# EAGLE design W700X (EAGLE 6.6.0)
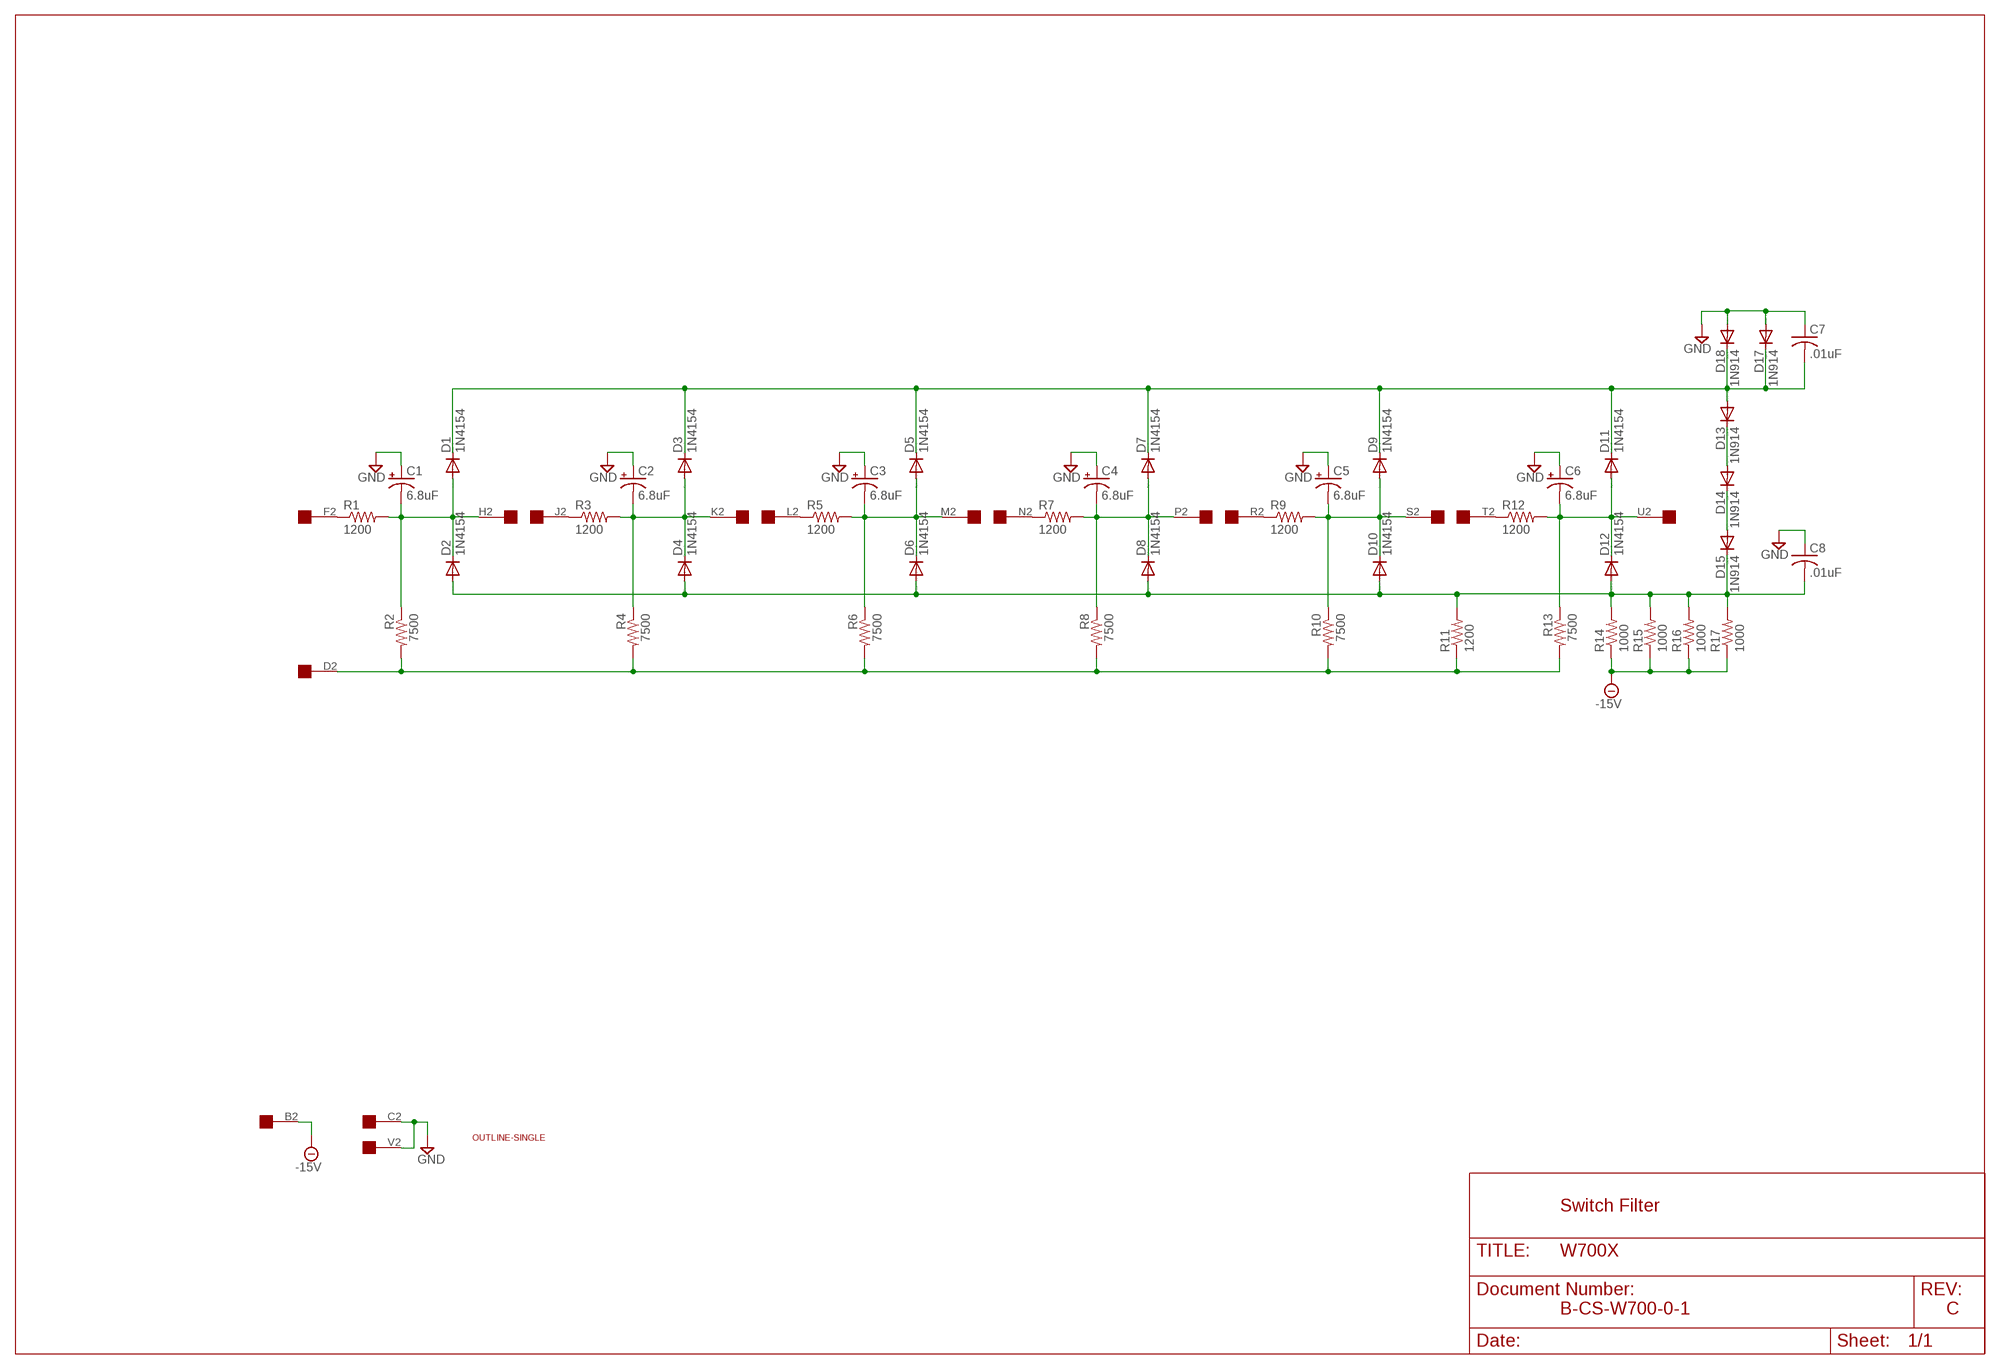
[diagram p0: schematic, sheet 1]

## Parts
C1  6.8uF  CPOL-USE20-8AXIAL  [E12-8]
C2  6.8uF  CPOL-USE20-8AXIAL  [E12-8]
C3  6.8uF  CPOL-USE20-8AXIAL  [E12-8]
C4  6.8uF  CPOL-USE20-8AXIAL  [E12-8]
C5  6.8uF  CPOL-USE20-8AXIAL  [E12-8]
C6  6.8uF  CPOL-USE20-8AXIAL  [E12-8]
C7  .01uF  C-US150-054X183  [C150-054X183]
C8  .01uF  C-US150-054X183  [C150-054X183]
D1  1N4154  DIODE-DO35-10  [DO35-10]
D2  1N4154  DIODE-DO35-10  [DO35-10]
D3  1N4154  DIODE-DO35-10  [DO35-10]
D4  1N4154  DIODE-DO35-10  [DO35-10]
D5  1N4154  DIODE-DO35-10  [DO35-10]
D6  1N4154  DIODE-DO35-10  [DO35-10]
D7  1N4154  DIODE-DO35-10  [DO35-10]
D8  1N4154  DIODE-DO35-10  [DO35-10]
D9  1N4154  DIODE-DO35-10  [DO35-10]
D10  1N4154  DIODE-DO35-10  [DO35-10]
D11  1N4154  DIODE-DO35-10  [DO35-10]
D12  1N4154  DIODE-DO35-10  [DO35-10]
D13  1N914  DIODE-DO35-10  [DO35-10]
D14  1N914  DIODE-DO35-10  [DO35-10]
D15  1N914  DIODE-DO35-10  [DO35-10]
D17  1N914  DIODE-DO35-10  [DO35-10]
D18  1N914  DIODE-DO35-10  [DO35-10]
R1  1200  R-US_0207/10  [0207/10]
R2  7500  R-US_0207/10  [0207/10]
R3  1200  R-US_0207/10  [0207/10]
R4  7500  R-US_0207/10  [0207/10]
R5  1200  R-US_0207/10  [0207/10]
R6  7500  R-US_0207/10  [0207/10]
R7  1200  R-US_0207/10  [0207/10]
R8  7500  R-US_0207/10  [0207/10]
R9  1200  R-US_0207/10  [0207/10]
R10  7500  R-US_0207/10  [0207/10]
R11  1200  R-US_0207/10  [0207/10]
R12  1200  R-US_0207/10  [0207/10]
R13  7500  R-US_0207/10  [0207/10]
R14  1000  R-US_0207/10  [0207/10]
R15  1000  R-US_0207/10  [0207/10]
R16  1000  R-US_0207/10  [0207/10]
R17  1000  R-US_0207/10  [0207/10]
U$1  OUTLINE-SINGLE  [SINGLE]
U$3  EDGE-1  [EDGE-CON1]

## Nets
-15V: R14.1 R15.1 R16.1 R17.1 U$3.B2
D2: R2.2 R4.2 R6.2 R8.2 R10.2 R11.1 R13.2 U$3.D2
F2: R1.1 U$3.F2
GND: C1.+ C2.+ C3.+ C4.+ C5.+ C6.+ C7.1 C8.1 D17.A D18.A U$3.C2 U$3.V2
H2: C1.- D1.A D2.C R1.2 R2.1 U$3.H2
J2: R3.1 U$3.J2
K2: C2.- D3.A D4.C R3.2 R4.1 U$3.K2
L2: R5.1 U$3.L2
N$1: C8.2 D2.A D4.A D6.A D8.A D10.A D12.A D15.C R11.2 R14.2 R15.2 R16.2 R17.2
N$2: R7.1 U$3.N2
N$3: C3.- D5.A D6.C R5.2 R6.1 U$3.M2
N$4: C7.2 D1.C D3.C D5.C D7.C D9.C D11.C D13.A D17.C D18.C
N$5: D14.C D15.A
N$6: D13.C D14.A
P2: C4.- D7.A D8.C R7.2 R8.1 U$3.P2
R2: R9.1 U$3.R2
S2: C5.- D9.A D10.C R9.2 R10.1 U$3.S2
T2: R12.1 U$3.T2
U2: C6.- D11.A D12.C R12.2 R13.1 U$3.U2
Unconnected: U$3.A2 U$3.E2

## Notes on the sheet
- Switch Filter
- B-CS-W700-0-1 | C

## Library data of the parts
C1-C6 = dec-con:CPOL-USE20-8AXIAL: A 0.8 inch electrolytic.
C7 C8 = rcl:C-US: CAPACITOR, American symbol
D1-D15 D17 D18 = diode:DIODE-: DIODE
R1-R17 = rcl:R-US_: RESISTOR, American symbol
U$1 = dec-con:OUTLINE-*: Board outlines for DEC boards.
U$3 = dec-con:EDGE-1: Single-Sided DEC Edge Connector -- (side 2)

## Board
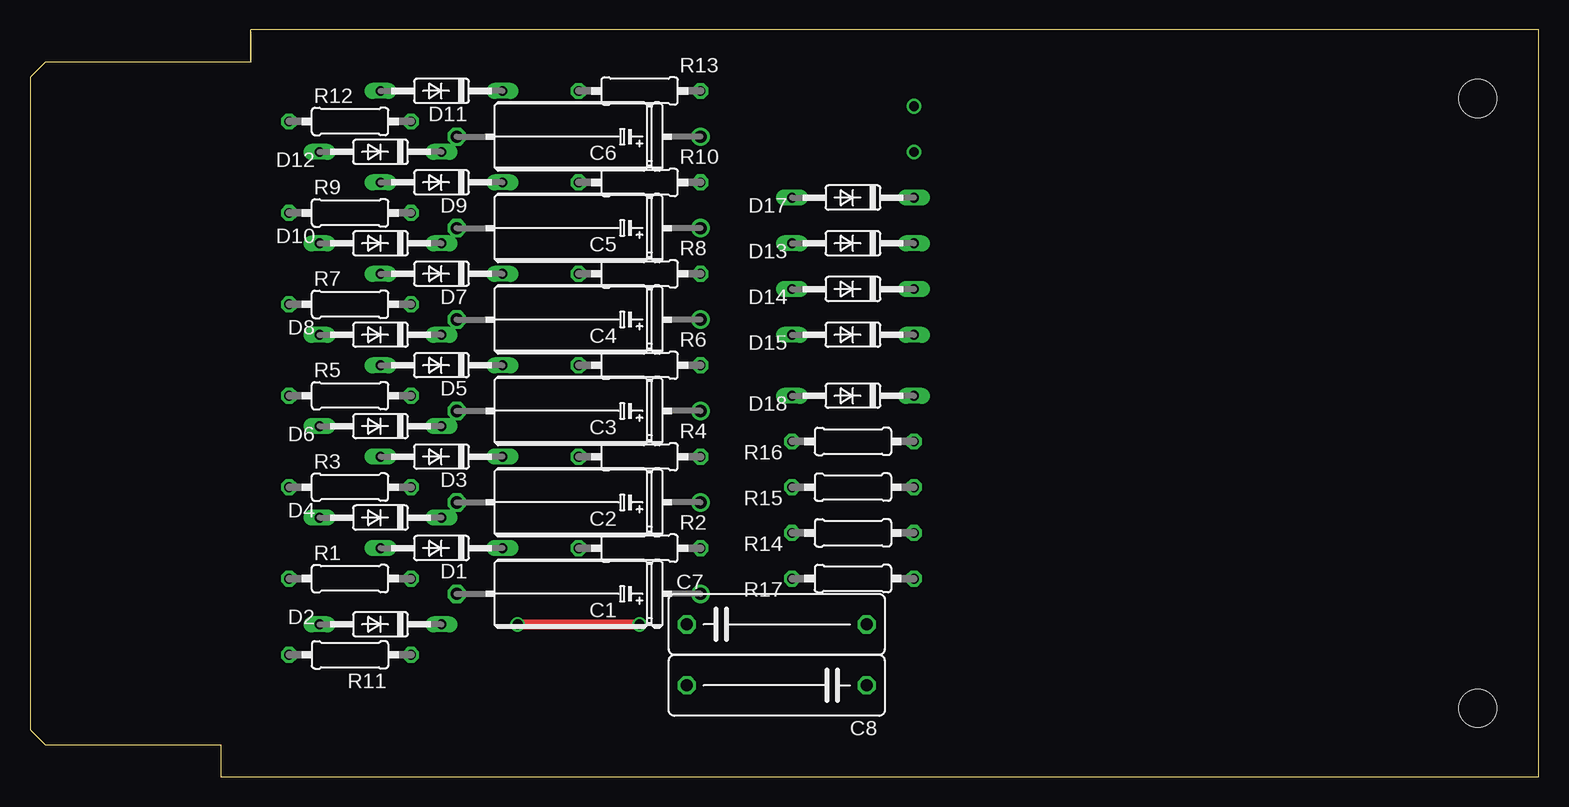
[diagram p1: board, top side]
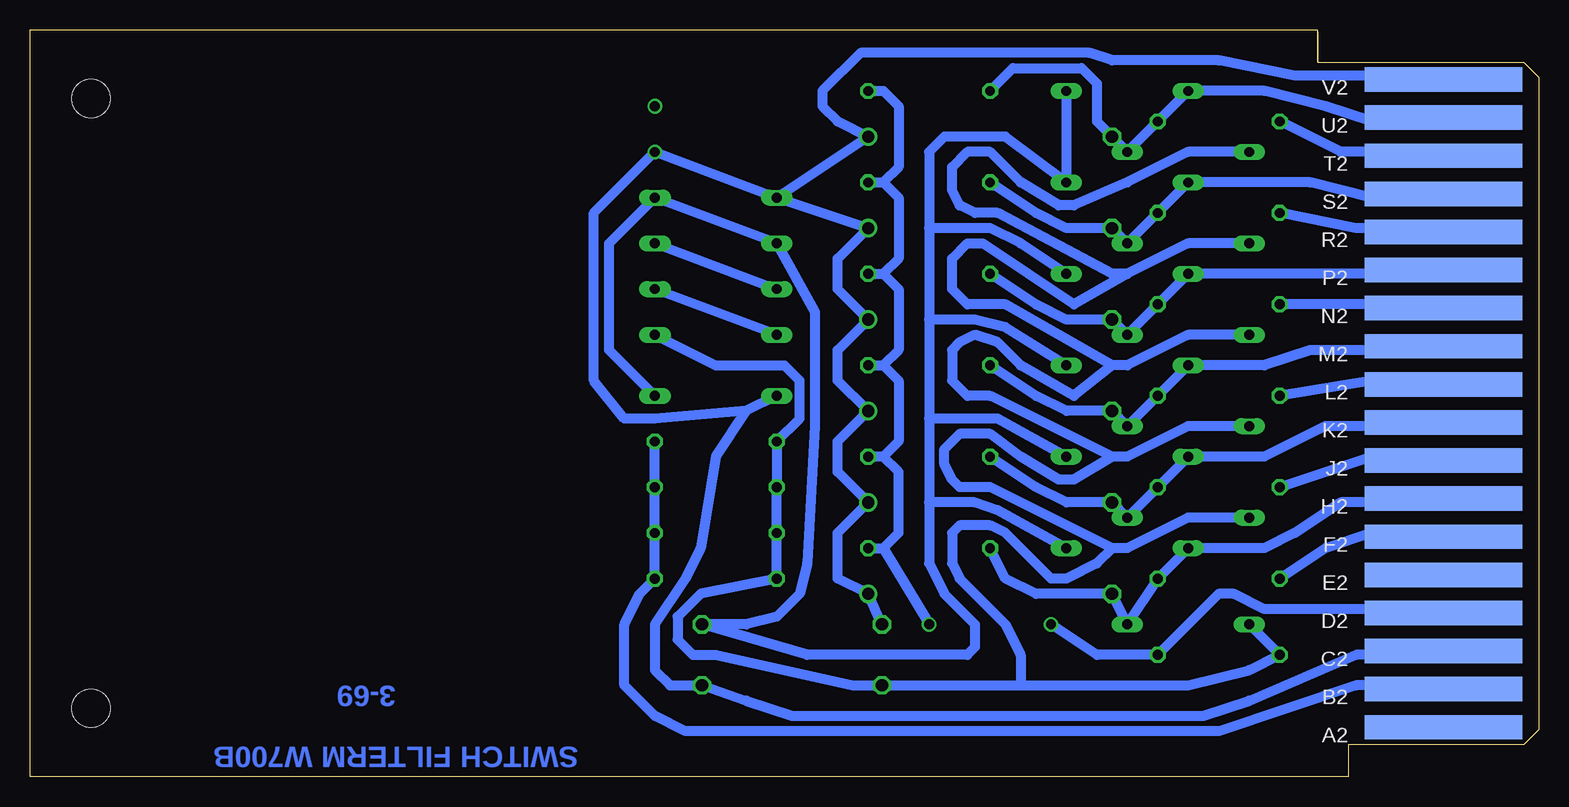
[diagram p2: board, bottom side, seen from below]

Size 125.73 x 62.23 mm. Coordinates in mm from the lower left corner, seen from the top.
Copper layers (1+16): Top 0.035mm / dielectric 1.5mm / Bottom 0.035mm
Design rules "16mils": minimum track width 16mil, minimum drill 32mil, track to track 15mil, track to pad 10mil, pad to pad 10mil, via to via 10mil, smd to smd 10mil, copper to edge 13mil, drill to drill 10mil, minimum pad ring 10mil, minimum via ring 8mil, stop-mask expansion 0mil, vias tented up to drill 0mil, thermal gap 10mil

### Footprints (pad centres in the part's own frame; a part is rotated, then mirrored left to right if it is on the bottom)
E12-8 = drill 1.016: + -10.16,0 | drill 1.016 octagon: - 10.16,0
C150-054X183 = drill 1.016 octagon: 1 -7.493,0; 2 7.493,0
DO35-10 = drill 0.813 long: A 5.08,0; C -5.08,0
0207/10 = drill 0.813 octagon: 1 -5.08,0; 2 5.08,0
SINGLE = hole 3.175: 120.65,56.515; 120.65,5.715
EDGE-CON1 = smd 13.106 x 2.032 bottom: A2 7.938,4.128; B2 7.938,7.303; C2 7.938,10.477; D2 7.938,13.652; E2 7.938,16.828; F2 7.938,20.003; H2 7.938,23.177; J2 7.938,26.352; K2 7.938,29.527; L2 7.938,32.703; M2 7.938,35.877; N2 7.938,39.053; P2 7.938,42.227; R2 7.938,45.403; S2 7.938,48.578; T2 7.938,51.752; U2 7.938,54.928; V2 7.938,58.102

### Placement (x,y rotation side)
C1  45.72,15.24 180 top
C2  45.72,22.86 180 top
C3  45.72,30.48 180 top
C4  45.72,38.1 180 top
C5  45.72,45.72 180 top
C6  45.72,53.34 180 top
C7  62.23,12.7 0 top
C8  62.23,7.62 180 top
D1  34.29,19.05 180 top
D2  29.21,12.7 180 top
D3  34.29,26.67 180 top
D4  29.21,21.59 180 top
D5  34.29,34.29 180 top
D6  29.21,29.21 180 top
D7  34.29,41.91 180 top
D8  29.21,36.83 180 top
D9  34.29,49.53 180 top
D10  29.21,44.45 180 top
D11  34.29,57.15 180 top
D12  29.21,52.07 180 top
D13  68.58,44.45 180 top
D14  68.58,40.64 180 top
D15  68.58,36.83 180 top
D17  68.58,48.26 180 top
D18  68.58,31.75 180 top
R1  26.67,16.51 0 top
R2  50.8,19.05 0 top
R3  26.67,24.13 0 top
R4  50.8,26.67 0 top
R5  26.67,31.75 0 top
R6  50.8,34.29 0 top
R7  26.67,39.37 0 top
R8  50.8,41.91 0 top
R9  26.67,46.99 0 top
R10  50.8,49.53 0 top
R11  26.67,10.16 180 top
R12  26.67,54.61 0 top
R13  50.8,57.15 0 top
R14  68.58,20.32 180 top
R15  68.58,24.13 180 top
R16  68.58,27.94 180 top
R17  68.58,16.51 180 top
U$1  0,0 0 top
U$3  0,0 0 top

### Tracks (layer width: path | path; a pad name or v marks a point on that pad's centre or on a via)
-15V
  Bottom 0.813: R16.1 R15.1 R14.1 R17.1 74.93,15.24 76.2,12.7 76.2,7.62 73.66,5.08 71.12,3.81 26.67,3.81 15.24,7.62 8.89,7.62 U$3.B2
D2  (via drill 0.81)
  Top 0.813: v40.64,12.7 v50.8,12.7
  Bottom 0.813: R8.2 54.61,41.91 | 54.61,41.91 53.34,40.64 53.34,35.56 54.61,34.29 | R10.2 54.61,49.53 | 54.61,49.53 53.34,48.26 53.34,43.18 54.61,41.91 | R6.2 54.61,34.29 | 54.61,34.29 53.34,33.02 53.34,27.94 54.61,26.67 | 54.61,26.67 R4.2 | R2.2 54.61,19.05 | 54.61,19.05 53.34,20.32 53.34,25.4 54.61,26.67 | R13.2 54.61,57.15 53.34,55.88 53.34,50.8 54.61,49.53 | v40.64,12.7 36.83,10.16 R11.1 26.67,15.24 25.4,15.24 22.86,13.97 8.89,13.97 U$3.D2 | 54.61,19.05 v50.8,12.7
F2
  Bottom 0.813: U$3.F2 8.89,20.32 13.97,20.32 17.78,19.05 R1.1
GND  (via drill 0.81)
  Bottom 0.813: U$3.V2 8.89,58.42 20.32,58.42 26.67,59.69 35.56,59.69 37.47,60.33 56.52,60.33 59.69,57.15 59.69,55.88 58.42,54.61 C6.+ D17.A | D17.A C5.+ 58.42,43.18 58.42,40.64 C4.+ 58.42,35.56 58.42,33.02 C3.+ 58.42,27.94 58.42,25.4 C2.+ 58.42,20.32 58.42,16.51 C1.+ C7.1 | D18.A 66.04,30.48 | 66.04,30.48 73.66,29.84 76.2,29.84 78.74,33.02 78.74,46.99 v73.66,52.07 D17.A | U$3.C2 8.89,10.16 15.24,10.16 24.13,6.35 27.94,5.08 62.23,5.08 66.04,6.35 C8.1 72.39,7.62 73.66,8.89 73.66,12.7 71.12,16.51 69.85,19.05 68.58,26.67 66.04,30.48
H2
  Bottom 0.813: U$3.H2 8.89,22.86 16.51,22.86 20.32,20.32 22.86,19.05 D1.A R1.2 D2.C C1.- 41.91,15.24 44.45,16.51 R2.1
J2
  Bottom 0.813: U$3.J2 8.89,26.67 13.97,26.67 R3.1
K2
  Bottom 0.813: U$3.K2 8.89,29.21 17.78,29.21 22.86,26.67 D3.A R3.2 D4.C C2.- 39.37,22.86 41.91,24.13 R4.1
L2
  Bottom 0.813: U$3.L2 8.89,33.02 13.97,33.02 R5.1
N$1
  Bottom 0.813: D15.C 68.58,34.29 62.87,34.29 61.6,33.02 61.6,29.84 R16.2 R15.2 R14.2 R17.2 69.85,15.24 71.76,13.34 71.76,11.43 70.49,10.16 68.58,10.16 57.15,7.62 C8.2 43.18,7.62 | 43.18,7.62 29.21,7.62 24.13,8.89 R11.2 D2.A | D12.A 29.21,52.07 34.29,49.53 38.74,47.62 40.01,47.62 43.18,49.53 45.72,52.07 47.63,52.07 48.9,50.8 48.9,48.9 48.26,47.62 46.99,46.99 45.09,46.99 35.56,41.91 34.29,41.91 | D10.A 29.21,44.45 34.29,41.91 | D8.A 29.21,36.83 34.29,34.29 35.56,34.29 | D6.A 29.21,29.21 34.29,26.67 35.56,26.67 | D4.A 29.21,21.59 34.29,19.05 35.56,19.05 | 35.56,19.05 45.72,24.13 48.26,24.13 48.9,24.77 49.53,26.04 49.53,27.3 48.26,28.57 45.72,28.57 43.18,26.67 40.01,24.77 38.74,24.77 35.56,26.67 | 35.56,26.67 45.72,31.75 47.63,31.75 48.9,33.02 48.9,35.56 48.26,36.2 46.99,36.83 45.09,36.2 43.18,34.29 38.74,31.75 35.56,34.29 | 35.56,19.05 36.83,17.78 39.37,16.51 40.64,16.51 44.45,20.32 45.72,20.95 48.26,20.95 48.9,20.32 48.9,17.78 48.26,16.51 44.45,12.7 43.18,10.16 43.18,7.62 | 34.29,41.91 38.74,39.37 46.36,44.45 47.63,44.45 48.9,43.18 48.9,40.64 47.63,39.37 44.45,39.37 35.56,34.29
N$2
  Bottom 0.813: U$3.N2 8.89,39.37 R7.1
N$3
  Bottom 0.813: U$3.M2 8.89,35.56 19.05,35.56 22.86,34.29 D5.A R5.2 D6.C C3.- 39.37,30.48 41.91,31.75 R6.1
N$4
  Bottom 0.813: D18.C 77.47,35.56 77.47,44.45 D17.C D13.A 60.33,38.73 60.33,29.21 60.96,17.78 61.6,15.24 63.5,13.34 66.04,12.7 C7.2 60.96,10.16 47.63,10.16 46.99,10.79 46.99,12.7 49.53,15.24 50.8,17.78 50.8,22.86 | D11.C D9.C 44.45,53.34 49.53,53.34 50.8,52.07 50.8,45.72 | 50.8,45.72 50.8,38.1 | 50.8,38.1 50.8,29.84 | 50.8,29.84 50.8,22.86 | D1.C 45.09,22.23 46.99,22.86 50.8,22.86 | D3.C 45.09,29.84 50.8,29.84 | D5.C 44.45,37.47 46.99,38.1 50.8,38.1 | D7.C 43.18,44.45 45.72,45.72 50.8,45.72
N$5
  Bottom 0.813: D15.A D14.C
N$6
  Bottom 0.813: D13.C D14.A
N$7  (via drill 0.81)
  other vias: 73.66,55.88
P2
  Bottom 0.813: U$3.P2 8.89,41.91 D7.A R7.2 D8.C C4.- 39.37,38.1 41.91,39.37 R8.1
R2
  Bottom 0.813: U$3.R2 8.89,45.72 15.24,45.72 R9.1
S2
  Bottom 0.813: U$3.S2 8.89,48.26 13.97,48.26 19.05,49.53 D9.A R9.2 D10.C C5.- 39.37,45.72 41.91,46.99 R10.1
T2
  Bottom 0.813: U$3.T2 8.89,52.07 16.51,52.07 R12.1
U2
  Bottom 0.813: U$3.U2 8.89,54.61 13.97,54.61 17.78,55.88 22.86,57.15 D11.A R12.2 D12.C C6.- 36.83,54.61 36.83,57.78 38.1,59.05 43.82,59.05 R13.1

### Text on the board
Bottom: 3-69 | SWITCH FILTERM W700B